# EAGLE design CarTalkImu (EAGLE 7.6.0)
AUTHOR: w. boyett; CONTACT_ADDRESS: Licensed under CC-BY-SA; CONTACT_COMPANY: github.com/watsonboyett; CONTACT_PHONE: (Creative Commons, Attribution + Share Alike); REV: 1A
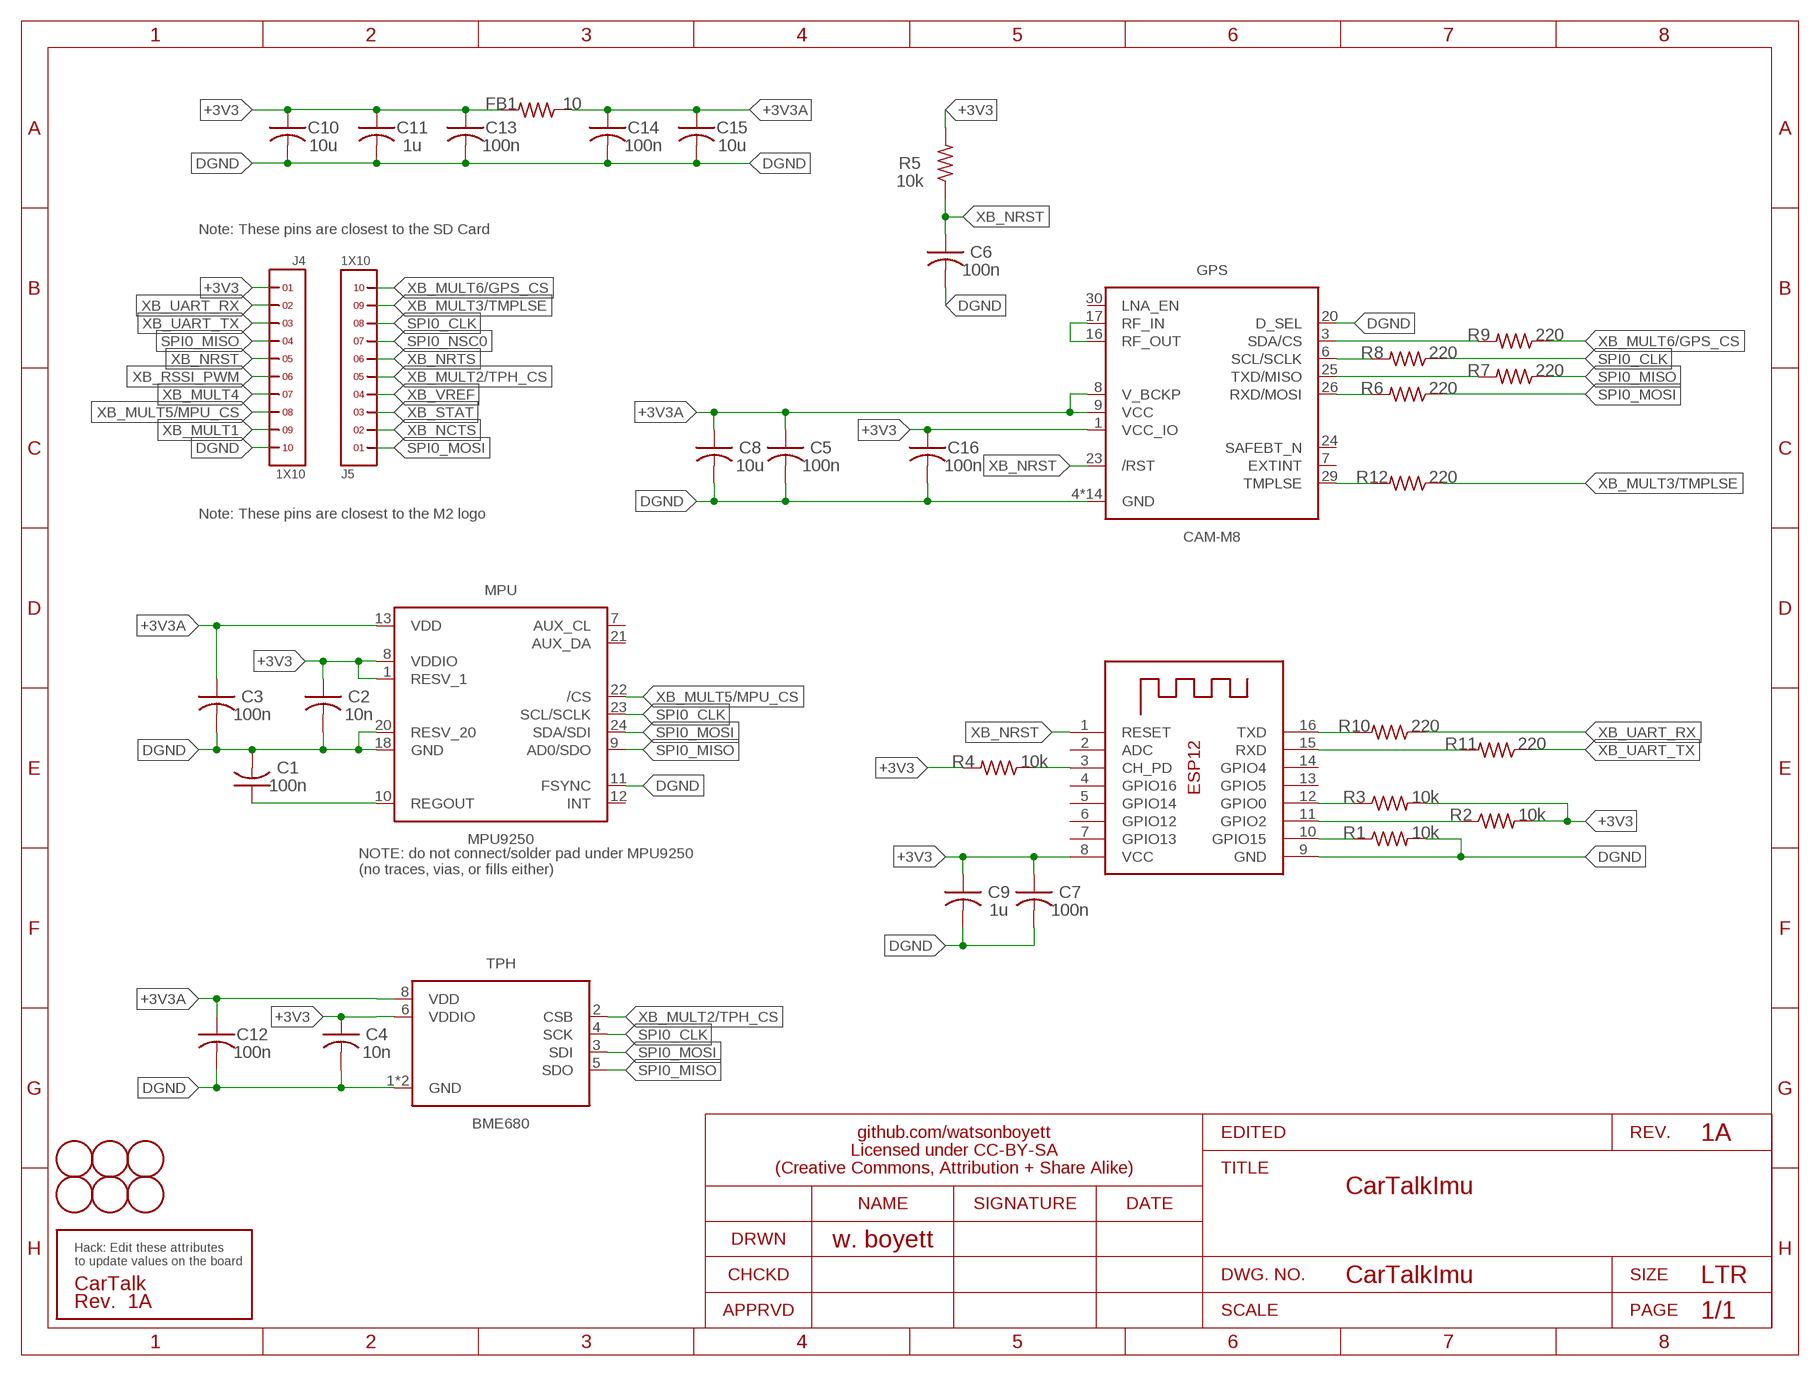
[diagram p0: schematic, sheet 1]

## Parts
C1  100n  C-USC0603  [C0603]
C2  10n  C-USC0603  [C0603]
C3  100n  C-USC0603  [C0603]
C4  10n  C-USC0603  [C0603]
C5  100n  C-USC0603  [C0603]
C6  100n  C-USC0603  [C0603]
C7  100n  C-USC0603  [C0603]
C8  10u  C-USC0805  [C0805]
C9  1u  C-USC0603  [C0603]
C10  10u  C-USC0805  [C0805]
C11  1u  C-USC0603  [C0603]
C12  100n  C-USC0603  [C0603]
C13  100n  C-USC0603  [C0603]
C14  100n  C-USC0603  [C0603]
C15  10u  C-USC0805  [C0805]
C16  100n  C-USC0603  [C0603]
FB1  10  R-US_R0603  [R0603]
GPS  CAM-M8  [CAM-M8]
J4  1X10  [1X10]
J5  1X10  [1X10]
MPU  MPU9250  [QFN24-NP]
R1  10k  R-US_R0603  [R0603]
R2  10k  R-US_R0603  [R0603]
R3  10k  R-US_R0603  [R0603]
R4  10k  R-US_R0603  [R0603]
R5  10k  R-US_R0603  [R0603]
R6  220  R-US_R0603  [R0603]
R7  220  R-US_R0603  [R0603]
R8  220  R-US_R0603  [R0603]
R9  220  R-US_R0603  [R0603]
R10  220  R-US_R0603  [R0603]
R11  220  R-US_R0603  [R0603]
R12  220  R-US_R0603  [R0603]
TPH  BME680  [BME-DFN8]
U$5  SILK_QC  [SILK_QC]
U$6  FIDUCIAL  [FIDUCIAL_1MM]
U$7  FIDUCIAL  [FIDUCIAL_1MM]
U$8  FIDUCIAL  [FIDUCIAL_1MM]
U$9  FIDUCIAL  [FIDUCIAL_1MM]
U$10  FIDUCIAL  [FIDUCIAL_1MM]
U$11  FIDUCIAL  [FIDUCIAL_1MM]
WIFI  ESP-12  [ESP-12]

## Nets
+3V3: C2.1 C4.1 C7.1 C9.1 C10.1 C11.1 C13.1 C16.1 FB1.2 GPS.1(VCC_IO) J4.1 MPU.1(RESV_1) MPU.8(VDDIO) R1.2 R2.2 R4.2 R5.2 TPH.6(VDDIO) WIFI.8(VCC)
+3V3A: C3.1 C5.1 C8.1 C12.1 C14.1 C15.1 FB1.1 GPS.8(V_BCKP) GPS.9(VCC) MPU.13(VDD) TPH.8(VDD)
DGND: C1.2 C2.2 C3.2 C4.2 C5.2 C6.2 C7.2 C8.2 C9.2 C10.2 C11.2 C12.2 C13.2 C14.2 C15.2 C16.2 GPS.4(GND) GPS.5(GND) GPS.10(GND) GPS.11(GND) GPS.12(GND) GPS.13(GND) GPS.14(GND) GPS.15(GND) GPS.18(GND) GPS.19(GND) GPS.20(D_SEL) GPS.21(GND) GPS.22(GND) GPS.27(GND) GPS.31(GND) J4.10 MPU.11(FSYNC) MPU.18(GND) MPU.20(RESV_20) R3.2 TPH.1(GND) TPH.7(GND) WIFI.9(GND)
N$4: C1.1 MPU.10(REGOUT)
N$6: R1.1 WIFI.12(GPIO0)
N$7: R2.1 WIFI.11(GPIO2)
N$8: R3.1 WIFI.10(GPIO15)
N$9: R4.1 WIFI.3(CH_PD)
N$10: GPS.26(RXD/MOSI) R6.2
N$11: GPS.25(TXD/MISO) R7.2
N$12: GPS.6(SCL/SCLK) R8.2
N$13: GPS.3(SDA/CS) R9.2
N$14: GPS.16(RF_OUT) GPS.17(RF_IN)
N$15: R10.2 WIFI.16(TXD)
N$16: R11.2 WIFI.15(RXD)
N$18: GPS.29(TMPLSE) R12.2
SPI0_CLK: J5.8 MPU.23(SCL/SCLK) R8.1 TPH.4(SCK)
SPI0_MISO: J4.4 MPU.9(AD0/SDO) R7.1 TPH.5(SDO)
SPI0_MOSI: J5.1 MPU.24(SDA/SDI) R6.1 TPH.3(SDI)
SPI0_NSC0: J5.7
XB_MULT1: J4.9
XB_MULT2/TPH_CS: J5.5 TPH.2(CSB)
XB_MULT3/TMPLSE: J5.9 R12.1
XB_MULT4: J4.7
XB_MULT5/MPU_CS: J4.8 MPU.22(/CS)
XB_MULT6/GPS_CS: J5.10 R9.1
XB_NCTS: J5.2
XB_NRST: C6.1 GPS.23(/RST) J4.5 R5.1 WIFI.1(RESET)
XB_NRTS: J5.6
XB_RSSI_PWM: J4.6
XB_STAT: J5.3
XB_UART_RX: J4.2 R10.1
XB_UART_TX: J4.3 R11.1
XB_VREF: J5.4
Unconnected: GPS.7(EXTINT) GPS.24(SAFEBT_N) GPS.30(LNA_EN) MPU.7(AUX_CL) MPU.12(INT) MPU.21(AUX_DA) WIFI.2(ADC) WIFI.4(GPIO16) WIFI.5(GPIO14) WIFI.6(GPIO12) WIFI.7(GPIO13) WIFI.13(GPIO5) WIFI.14(GPIO4)

## Notes on the sheet
- Note: These pins are closest to the SD Card
- Note: These pins are closest to the M2 logo
- NOTE: do not connect/solder pad under MPU9250
  (no traces, vias, or fills either)

## Library data of the parts
C1-C16 = CarTalkImu:C-US: CAPACITOR, American symbol
FB1 R1-R12 = CarTalkImu:R-US_: RESISTOR, American symbol
GPS = CarTalkImu:CAM-M8: IC RECEIVER GPS CHIP ANT 31LCC RF Receiver BeiDou, GLONASS, GNSS, GPS 1.575GHz -167dBm On-Board, Chip Module; MFG: U-Blox America Inc.; MPN: CAM-M8Q-0; PN-DK: 672-1013-1-ND
J4 J5 = CarTalkImu:1X10
MPU = CarTalkImu:MPU9250: IMU ACCEL/GYRO/MAG I2C/SPI 24QFN; MFG: TDK InvenSense; MPN: MPU-9250; PN-DK: 1428-1019-1-ND
TPH = CarTalkImu:BME680: SENSOR Gas, Humidity, Pressure, Temperature Sensor, I²C, SPI Output; MFG: Bosch Sensortec; MPN: BME680; PN-DK: 828-1077-1-ND
U$5 = CarTalkImu:SILK_QC: Model/Version Tag Silkscreen; MPN: DNP; PRODUCT: CarTalk; REV: 1A
U$6-U$11 = CarTalkImu:FIDUCIAL: Fiducials For use by pick and place machines to calibrate the vision/machine, 1mm By microbuilder.eu; MPN: DNP
WIFI = CarTalkImu:ESP-12

## Board
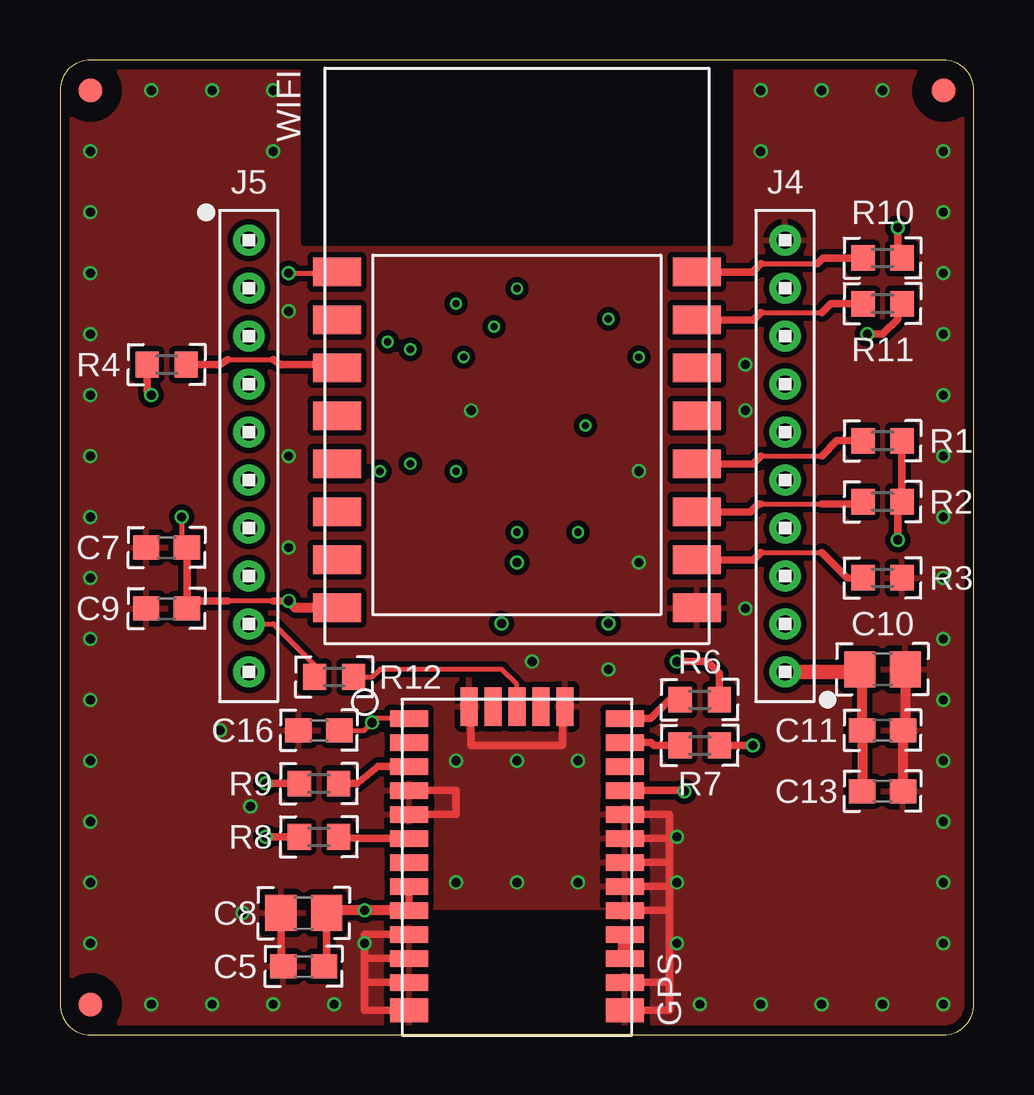
[diagram p1: board, top side]
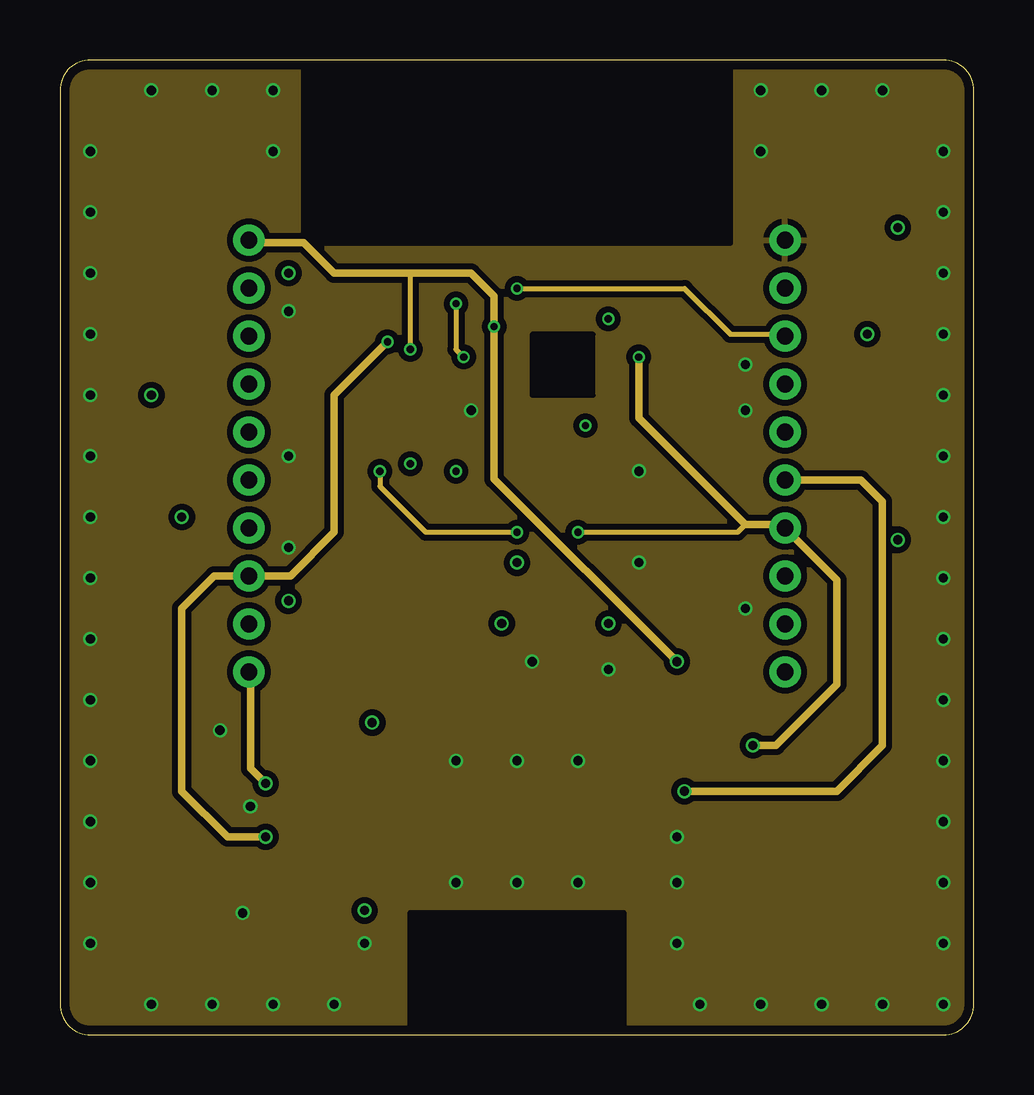
[diagram p2: board, inner layer Route2]
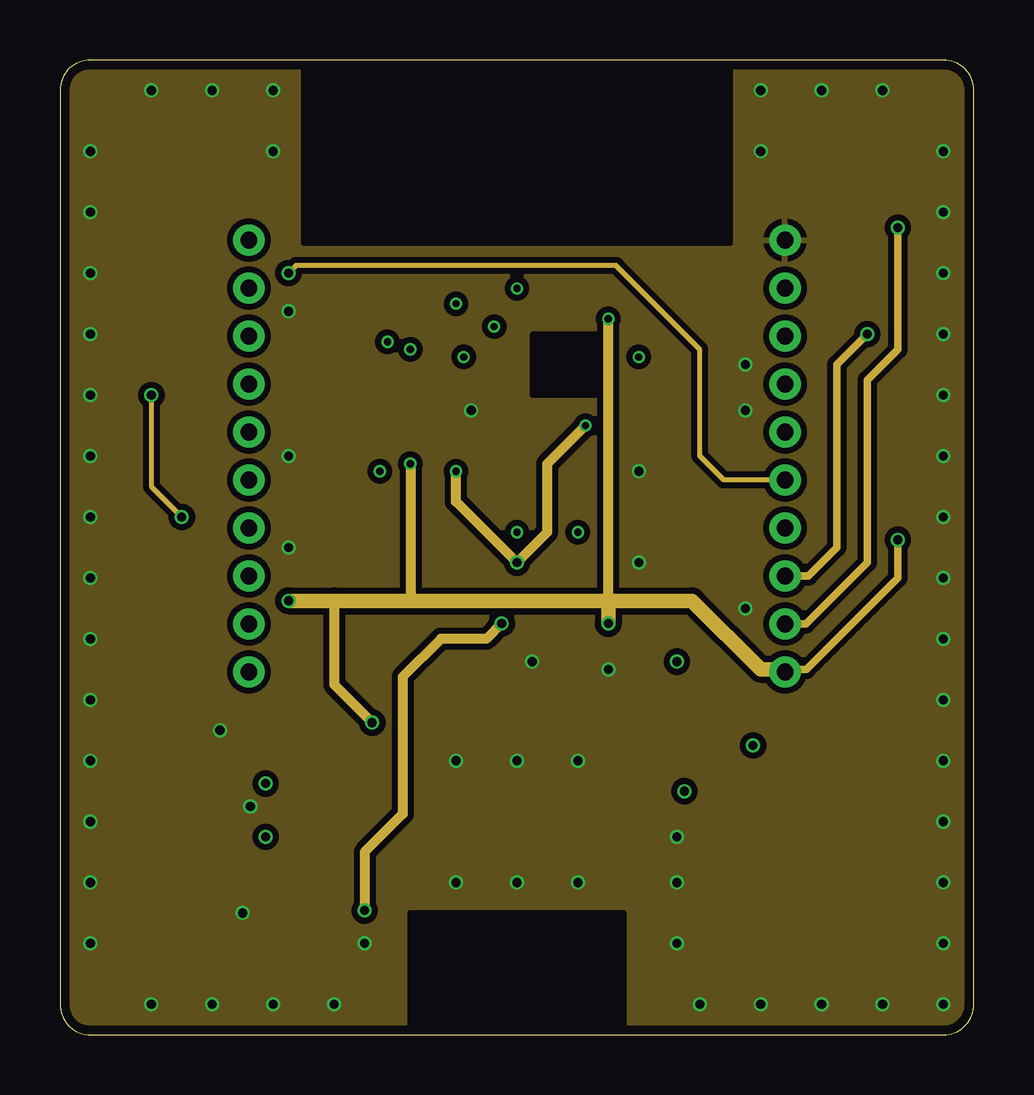
[diagram p3: board, inner layer Route15]
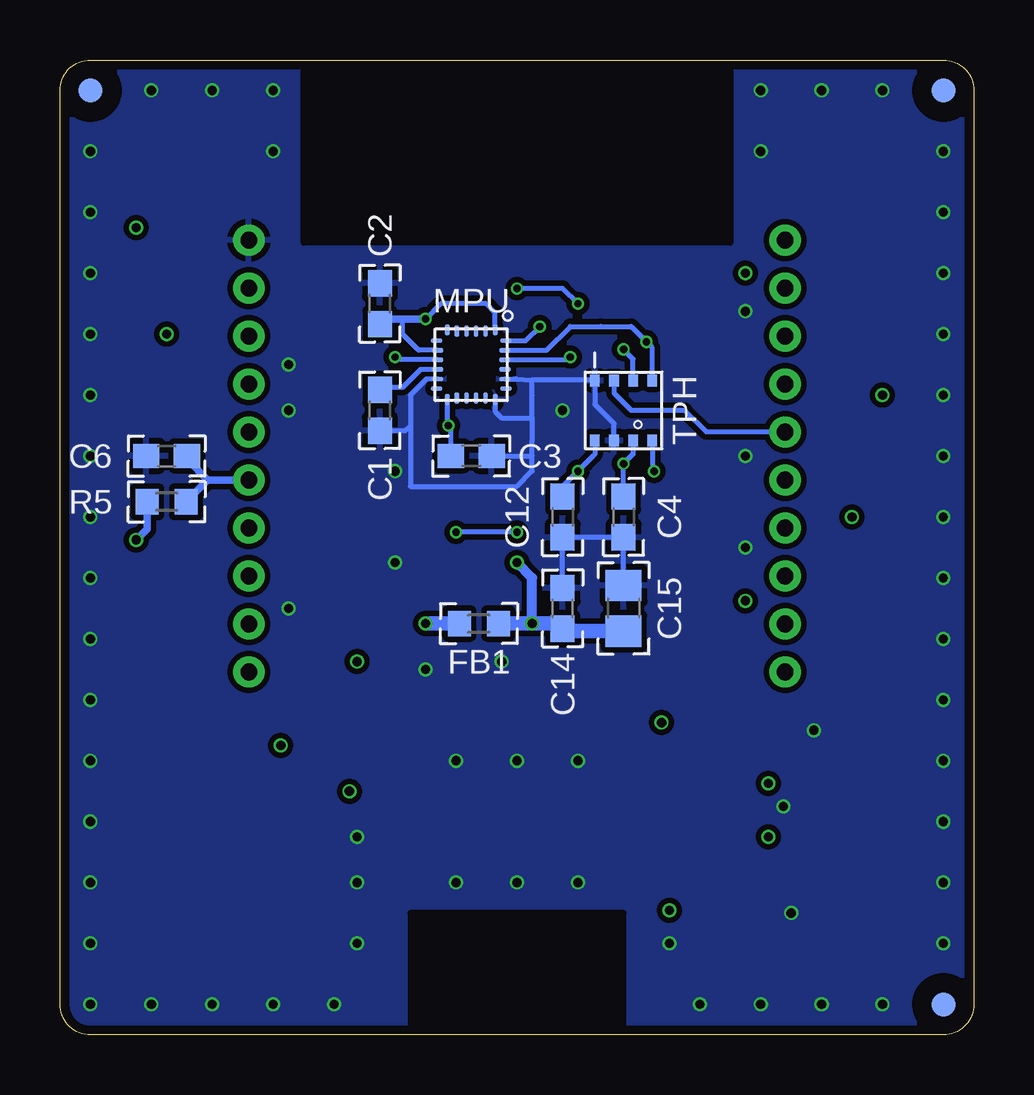
[diagram p4: board, bottom side, seen from below]

Size 38.1 x 40.64 mm. Coordinates in mm from the lower left corner, seen from the top.
Outline: 0,39.37 0,1.27 arc90 1.27,0 36.83,0 arc90 38.1,1.27 38.1,39.37 arc90 36.83,40.64 1.27,40.64 arc90 0,39.37
Copper layers (1*2*15*16): Top 0.035559375mm / dielectric 0.17018125mm / Route2 0.01778125mm / dielectric 47mil / Route15 0.01778125mm / dielectric 0.17018125mm / Bottom 0.035559375mm
Design rules "OshPark-4layer *": minimum track width 7mil, minimum drill 12mil, track to track 7mil, track to pad 7mil, pad to pad 7mil, via to via 7mil, smd to smd 7mil, copper to edge 15mil, drill to drill 6mil, minimum pad ring 4mil, minimum via ring 4mil, stop-mask expansion 2.5mil, vias tented up to drill 21mil, thermal gap 10mil

### Footprints (pad centres in the part's own frame; a part is rotated, then mirrored left to right if it is on the bottom)
C0603 = smd 1.1 x 1: 1 -0.85,0; 2 0.85,0
C0805 = smd 1.3 x 1.5: 1 -0.95,0; 2 0.95,0
R0603 = smd 0.965 x 1.067: 1 -0.813,0; 2 0.813,0
CAM-M8 = smd 1.6 x 0.7: 1 4.5,-6.2; 2 4.5,-5.2; 3 4.5,-4.2; 4 4.5,-3.2; 5 4.5,-2.2; 6 4.5,-1.2; 7 4.5,-0.2; 8 4.5,0.8; 9 4.5,1.8; 10 4.5,2.8; 11 4.5,3.8; 12 4.5,4.8; 15 -4.5,4.8; 16 -4.5,3.8; 17 -4.5,2.8; 18 -4.5,1.8; 19 -4.5,0.8; 20 -4.5,-0.2; 21 -4.5,-1.2; 22 -4.5,-2.2; 23 -4.5,-3.2; 24 -4.5,-4.2; 25 -4.5,-5.2; 26 -4.5,-6.2 | smd 1.6 x 1: 13 4.5,5.95; 14 -4.5,5.95 | smd 0.7 x 1.6: 27 -2,-6.7; 28 -1,-6.7; 29 0,-6.7; 30 1,-6.7; 31 2,-6.7
1X10 = drill 0.7 pad 1.3: 1 -9,0; 2 -7,0; 3 -5,0; 4 -3,0; 5 -1,0; 6 1,0; 7 3,0; 8 5,0; 9 7,0; 10 9,0
QFN24-NP = smd 0.2 x 0.48: 1 -1,-1.45; 2 -0.6,-1.4; 3 -0.2,-1.4; 4 0.2,-1.4; 5 0.6,-1.4; 6 1,-1.45; 13 1,1.45; 14 0.6,1.4; 15 0.2,1.4; 16 -0.2,1.4; 17 -0.6,1.4; 18 -1,1.45 | smd 0.48 x 0.2: 7 1.45,-1; 8 1.4,-0.6; 9 1.4,-0.2; 10 1.4,0.2; 11 1.4,0.6; 12 1.45,1; 19 -1.45,1; 20 -1.4,0.6; 21 -1.4,0.2; 22 -1.4,-0.2; 23 -1.4,-0.6; 24 -1.45,-1
BME-DFN8 = smd 0.5 x 0.4: 1 1.25,1.2; 2 1.25,0.4; 3 1.25,-0.4; 4 1.25,-1.2; 5 -1.25,-1.2; 6 -1.25,-0.4; 7 -1.25,0.4; 8 -1.25,1.2
FIDUCIAL_1MM = smd 1 x 1: 1 0,0
ESP-12 = smd 2 x 1.2: 1 -7.5,4.5; 2 -7.5,2.5; 3 -7.5,0.5; 4 -7.5,-1.5; 5 -7.5,-3.5; 6 -7.5,-5.5; 7 -7.5,-7.5; 8 -7.5,-9.5; 9 7.5,-9.5; 10 7.5,-7.5; 11 7.5,-5.5; 12 7.5,-3.5; 13 7.5,-1.5; 14 7.5,0.5; 15 7.5,2.5; 16 7.5,4.5

### Placement (x,y rotation side)
C1  24.77,26.04 270 bottom
C2  24.77,30.48 90 bottom
C3  20.96,24.13 0 bottom
C4  14.61,21.59 270 bottom
C5  10.16,2.86 180 top
C6  33.65,24.13 180 bottom
C7  4.45,20.32 180 top
C8  10.16,5.08 180 top
C9  4.45,17.78 180 top
C10  34.29,15.24 0 top
C11  34.29,12.7 0 top
C12  17.14,21.59 270 bottom
C13  34.29,10.16 0 top
C14  17.14,17.78 90 bottom
C15  14.61,17.78 90 bottom
C16  10.79,12.7 180 top
FB1  20.64,17.14 180 bottom
GPS  19.05,6.99 180 top
J4  30.23,24.13 90 top
J5  7.87,24.13 270 top
MPU  20.96,27.94 180 bottom
R1  34.29,24.77 0 top
R2  34.29,22.23 0 top
R3  34.29,19.05 0 top
R4  4.45,27.94 180 top
R5  33.65,22.23 180 bottom
R6  26.67,13.97 180 top
R7  26.67,12.07 180 top
R8  10.79,8.26 0 top
R9  10.79,10.48 0 top
R10  34.29,32.38 180 top
R11  34.29,30.48 180 top
R12  11.43,14.92 0 top
TPH  14.61,26.04 90 bottom
U$5  27.3,5.71 0 top
U$6  1.27,39.37 0 top
U$7  1.27,1.27 0 top
U$8  36.83,39.37 0 top
U$9  1.27,39.37 0 bottom
U$10  1.27,1.27 0 bottom
U$11  36.83,39.37 0 bottom
WIFI  19.05,27.3 0 top

### Tracks (layer width: path | path; a pad name or v marks a point on that pad's centre or on a via)
+3V3  (via drill 0.3, 0.38)
  Top 0.203: 8.89,18.1 6.99,18.1 | v5.08,21.59 5.08,20.54 C7.1 | C16.1 12.7,12.7 v13.02,13.02 13.19,13.19 GPS.1 | 33.44,15.14 C10.1 33.02,15.24 33.22,15.24 33.33,15.13
  Top 0.305: v9.53,18.1 8.89,18.1 | 6.99,18.1 5.29,18.1 | 5.29,18.1 C9.1 | 5.29,18.1 C7.1 | v34.92,20.64 34.92,21.91 R2.2 R1.2 | R4.2 3.63,26.85 v3.81,26.67
  Top 0.406: WIFI.8 9.82,17.8 v9.53,18.1 | 33.44,15.14 C11.1 C13.1
  Top 0.61: J4.1 33.33,15.13
  Route15 0.203: v3.81,26.67 3.81,22.86 v5.08,21.59
  Route15 0.305: 29.84,15.24 31.11,15.24 34.92,19.05 v34.92,20.64
  Route15 0.406: 22.86,18.1 v22.86,29.84 | v14.61,23.81 14.61,18.1 | 11.43,18.1 11.43,14.61 v13.02,13.02
  Route15 0.61: J4.1 30.12,15.24 29.84,15.24 29.21,15.24 26.35,18.1 22.86,18.1 | v9.53,18.1 11.43,18.1 14.61,18.1 22.86,18.1 | 22.86,18.1 v22.86,17.14
  Bottom 0.203: 23.81,29.84 23.81,29.21 23.14,28.54 MPU.8 | v22.86,29.84 22.23,30.48 20.32,30.48 19.96,30.12 MPU.1 | 24.66,29.53 C2.1 24.55,29.84 | C4.1 v14.61,23.81 14.21,24.21 TPH.6
  Bottom 0.305: v22.86,29.84 23.81,29.84 24.55,29.84 | R5.2 34.47,21.09 v34.92,20.64
  Bottom 0.61: v22.86,17.14 FB1.2
+3V3A  (via drill 0.3, 0.38)
  Top 0.305: GPS.8 GPS.9 | C5.1 11.11,2.86 C8.1
  Top 0.406: GPS.9 v12.7,5.19 11.21,5.19 C8.1
  Route15 0.406: v18.41,17.14 17.78,16.51 15.88,16.51 14.29,14.92 14.29,9.21 12.7,7.62 v12.7,5.19 | v16.51,23.5 16.51,22.23 v19.05,19.68 20.32,20.96 20.32,23.81 v21.91,25.4
  Bottom 0.203: TPH.8 15.8,24.2 15.88,24.13 | 15.88,24.13 16.19,23.81 | 16.19,23.81 15.88,24.13 | C12.1 17.14,22.86 v16.51,23.5 16.19,23.81 | 17.36,17.14 C14.1 17.05,16.83 | MPU.13 21.96,25.45 v21.91,25.4 21.8,25.3 C3.1
  Bottom 0.406: v18.41,17.14 18.41,19.05 v19.05,19.68
  Bottom 0.61: FB1.1 v18.41,17.14 17.36,17.14 | C15.1 17.05,16.83
DGND  (via drill 0.38)
  Top 0.203: 35.24,12.8 C11.2
  Top 0.305: C5.2 9.21,2.86 C8.2 | GPS.10 12.7,4.19 12.7,3.19 | 12.7,2.19 12.7,1.04 GPS.13 | GPS.12 12.7,2.19 | 12.7,2.19 12.7,2.54 12.7,3.18 12.7,3.19 | GPS.11 12.7,3.19 | GPS.14 25.4,1.04 25.4,2.19 | GPS.15 25.4,2.19 | GPS.18 25.4,5.19 | 25.4,5.19 25.4,6.19 | 25.4,7.19 25.4,6.35 25.4,6.19 | 25.4,8.19 25.4,7.62 25.4,7.19 | GPS.22 25.4,9.19 25.4,8.26 25.4,8.19 | GPS.21 25.4,8.19 | GPS.20 25.4,7.19 | GPS.19 25.4,6.19 | 25.4,5.19 25.4,2.19 | GPS.31 17.14,13.69 17.14,12.07 20.96,12.07 20.96,13.69 GPS.27 | GPS.4 16.51,10.19 16.51,9.19 GPS.5
  Top 0.406: C10.2 35.24,12.8 | C11.2 C13.2
  Bottom 0.203: MPU.20 19.09,27.34 18.41,27.3 | MPU.18 19.96,25.99 19.68,25.72 18.41,25.72 | 18.41,25.72 18.41,26.67 18.41,27.3 | MPU.11 22.82,27.34 23.5,26.67 23.5,25.4 | 23.5,25.4 23.5,22.86 19.05,22.86 18.41,23.5 18.41,24.13 | 18.41,24.13 18.41,24.77 18.41,25.4 18.41,25.72 | C3.2 18.41,24.13 | C1.2 23.71,25.18 23.5,25.4 | 18.41,27.3 15.88,27.3 15.86,27.29 TPH.1 15.8,26.28 15,25.48 TPH.7 | C15.2 C4.2 C12.2 C14.2
  other vias: 1.27,3.81 1.27,6.35 1.27,8.89 1.27,11.43 1.27,13.97 1.27,16.51 1.27,19.05 1.27,21.59 1.27,24.13 1.27,26.67 1.27,29.21 1.27,31.75 1.27,34.29 1.27,36.83 36.83,36.83 36.83,34.29 36.83,31.75 36.83,29.21 36.83,26.67 36.83,16.51 36.83,13.97 36.83,11.43 36.83,8.89 36.83,6.35 36.83,3.81 34.29,1.27 31.75,1.27 29.21,1.27 26.67,1.27 3.81,1.27 6.35,1.27 8.89,1.27 11.43,1.27 3.81,39.37 6.35,39.37 8.89,39.37 34.29,39.37 31.75,39.37 29.21,39.37 8.89,36.83 29.21,36.83 22.86,15.24 16.51,6.35 21.59,6.35 19.05,6.35 19.05,11.43 16.51,11.43 21.59,11.43 28.57,26.04 9.53,20.32 9.53,24.13 28.57,27.94 28.57,17.78 17.14,26.04 9.53,30.16 19.68,15.56 6.67,12.7 7.62,5.08 25.72,8.26 25.72,6.35 25.72,3.81 7.94,9.53 36.83,19.05 36.83,21.59 36.83,24.13 36.83,1.27 12.7,3.81 24.13,23.5 24.13,19.68
  pour Top (isolate 0.229): 0,0 38.1,0 38.1,40.64 0,40.64
  pour Route15 (isolate 0.254): 0,0 38.1,0 38.1,40.64 0,40.64
  pour Bottom (isolate 0.229): 0,0 38.1,0 38.1,40.64 0,40.64
  pour Route2 (isolate 0.254): 0,0 38.1,0 38.1,40.64 0,40.64
N$1
  cutout Top: 10.16,40.64 10.16,33.02 27.94,33.02 27.94,40.64
N$2
  cutout Route2: 10.16,40.64 10.16,33.02 27.94,33.02 27.94,40.64
N$3
  cutout Route15: 10.16,40.64 10.16,33.02 27.94,33.02 27.94,40.64
N$4
  Bottom 0.203: MPU.10 23.06,27.74 23.81,26.99 24.66,26.99 C1.1
N$5
  cutout Bottom: 10.16,40.64 10.16,33.02 27.94,33.02 27.94,40.64
N$6
  Top 0.203: 29.21,24.13 31.75,24.13
  Top 0.305: WIFI.12 28.89,23.8 29.21,24.13 | R1.1 32.38,24.77 31.75,24.13
N$7
  Top 0.203: 29.21,22.12 31.75,22.12
  Top 0.305: WIFI.11 28.79,21.8 29.11,22.12 29.21,22.12 | 31.75,22.12 33.38,22.12 R2.1
N$8
  Top 0.203: 29.21,20.12 31.75,20.12
  Top 0.305: WIFI.10 28.9,19.8 29.21,20.12 | R3.1 32.82,19.05 31.75,20.12
N$9
  Top 0.203: 6.99,28.14 8.89,28.14
  Top 0.305: R4.1 6.67,27.94 6.99,28.14 | 8.89,28.14 9.21,27.94 11.42,27.94 WIFI.3
N$10
  Top 0.305: GPS.26 24.62,13.19 25.4,13.97 R6.2
N$11
  Top 0.305: GPS.25 24.64,12.19 24.77,12.07 R7.2
N$12
  Top 0.305: GPS.6 12.31,8.19 R8.2
N$13
  Top 0.305: GPS.3 13.26,11.19 12.38,10.48 R9.2
N$14
  Top 0.61: GPS.17 GPS.16
N$15
  Top 0.203: 29.21,32.16 31.57,32.16
  Top 0.305: WIFI.16 28.86,31.81 29.21,32.16 | R10.2 31.8,32.38 31.57,32.16
N$16
  Top 0.203: 29.21,30.1 31.75,30.1
  Top 0.305: R11.2 32.7,30.48 32.13,30.48 31.75,30.1 | WIFI.15 28.92,29.8 29.21,30.1
N$17
  cutout Top: 14.92,0 14.92,5.08 22.86,5.08 22.86,0
  cutout Bottom: 14.61,0 14.61,5.08 23.5,5.08 23.5,0
  cutout Route15: 14.61,0 14.61,5.08 23.5,5.08 23.5,0
  cutout Route2: 14.61,0 14.61,5.08 23.5,5.08 23.5,0
N$18
  Top 0.203: GPS.29 19.05,14.61 18.41,15.24 13.34,15.24 13.02,14.92 R12.2
N$19
  cutout Bottom: 20,28.89 20,26.99 21.91,26.99 21.91,28.89
  cutout Route15: 19.68,29.21 19.68,26.67 22.23,26.67 22.23,29.21
  cutout Route2: 19.68,29.21 19.68,26.67 22.23,26.67 22.23,29.21
SPI0_CLK  (via drill 0.3, 0.38)
  Top 0.305: v8.57,8.26 R8.1
  Route2 0.305: v8.57,8.26 6.99,8.26 5.08,10.16 5.08,17.78 6.43,19.13 J5.8 9.61,19.13 11.43,20.96 11.43,26.67 v13.65,28.89
  Bottom 0.203: MPU.23 17.82,28.54 16.83,29.53 15.56,29.53 14.29,29.53 v13.65,28.89 13.41,28.64 TPH.4
SPI0_MISO  (via drill 0.3, 0.38)
  Top 0.305: R7.1 v28.89,12.07
  Route2 0.203: v13.34,23.5 13.34,22.86 15.24,20.96 v19.05,20.96 | v21.59,20.96 28.26,20.96 28.57,21.27
  Route2 0.305: v28.89,12.07 29.84,12.07 32.38,14.61 32.38,18.97 J4.4 30.08,21.27 28.57,21.27 24.13,25.72 v24.13,28.26
  Bottom 0.203: MPU.9 24.01,28.14 v24.13,28.26 | TPH.5 13.41,23.57 v13.34,23.5 | v19.05,20.96 v21.59,20.96
SPI0_MOSI  (via drill 0.3, 0.38)
  Top 0.305: R6.1 27.48,15.06 26.99,15.56 v25.72,15.56
  Route2 0.203: v14.61,28.57 14.61,31.75
  Route2 0.305: J5.1 7.98,33.02 10.16,33.02 11.43,31.75 14.61,31.75 17.14,31.75 18.1,30.8 v18.1,29.53 18.1,23.18 v25.72,15.56
  Bottom 0.203: MPU.24 18.68,28.94 v18.1,29.53 | TPH.3 14.21,28.18 v14.61,28.57
XB_MULT2/TPH_CS
  Bottom 0.203: J5.5 11.16,25.13 12.07,26.04 14.29,26.04 15,26.75 TPH.2
XB_MULT3/TMPLSE
  Top 0.203: J5.9 8.91,17.13 9.53,16.51 10.62,15.42 R12.1
XB_MULT5/MPU_CS  (via drill 0.3)
  Route2 0.203: v19.05,31.11 26.04,31.11 27.94,29.21 30.15,29.21 J4.8 | v16.51,30.48 16.51,28.57 v16.83,28.26
  Bottom 0.203: MPU.22 17.58,28.14 17.03,28.14 v16.83,28.26 | v16.51,30.48 17.14,31.11 v19.05,31.11
XB_MULT6/GPS_CS  (via drill 0.38)
  Top 0.305: R9.1 v8.57,10.48
  Route2 0.305: v8.57,10.48 7.94,11.11 7.94,15.07 J5.10
XB_NRST  (via drill 0.38)
  Top 0.203: v9.53,31.75 11.5,31.75 WIFI.1
  Top 0.305: GPS.23 26.01,10.19 v26.04,10.16
  Route2 0.305: v26.04,10.16 32.38,10.16 34.29,12.07 34.29,22.23 33.38,23.13 J4.5
  Route15 0.203: J4.5 27.67,23.13 26.67,24.13 26.67,28.57 23.18,32.07 9.84,32.07 v9.53,31.75
  Bottom 0.305: J4.5 31.94,23.13 | 31.94,23.13 R5.1 | C6.1 32.8,24 31.94,23.13
XB_UART_RX  (via drill 0.38)
  Top 0.305: v34.92,33.65 34.92,32.56 R10.1
  Route15 0.305: J4.2 31.1,17.13 33.65,19.68 33.65,27.3 34.92,28.57 v34.92,33.65
XB_UART_TX  (via drill 0.38)
  Top 0.305: v33.65,29.21 34.29,29.21 34.92,29.84 34.92,30.3 R11.1
  Route15 0.305: J4.3 31.2,19.13 32.38,20.32 32.38,27.94 v33.65,29.21

### Text on the board
Document: SD Card | PCB Layer Stack-up: / L1: top components + ground plane / L2: signals + RF traces / L3: ground + power planes / L4: ground plane, short traces